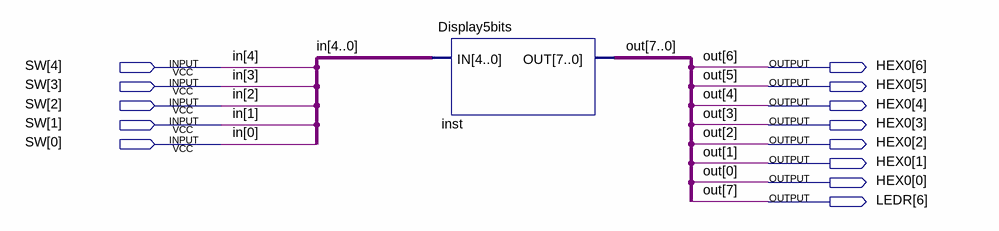
[diagram p0: schematic sheet]
// Quartus schematic Placa.bdf as structural Verilog: 1 symbols, 13 pins
module Placa (
  input  [4:0] SW,
  output [6:0] HEX0,
  output [6:6] LEDR
);

  Display5bits inst (.IN(SW), .OUT({LEDR[6], HEX0}));

  // Other names for the same wires on the sheet: in[4:0] = SW; out[7:0] = {LEDR[6], HEX0}
endmodule
